# EAGLE design Spooky Sound System (EAGLE 7.6.0)
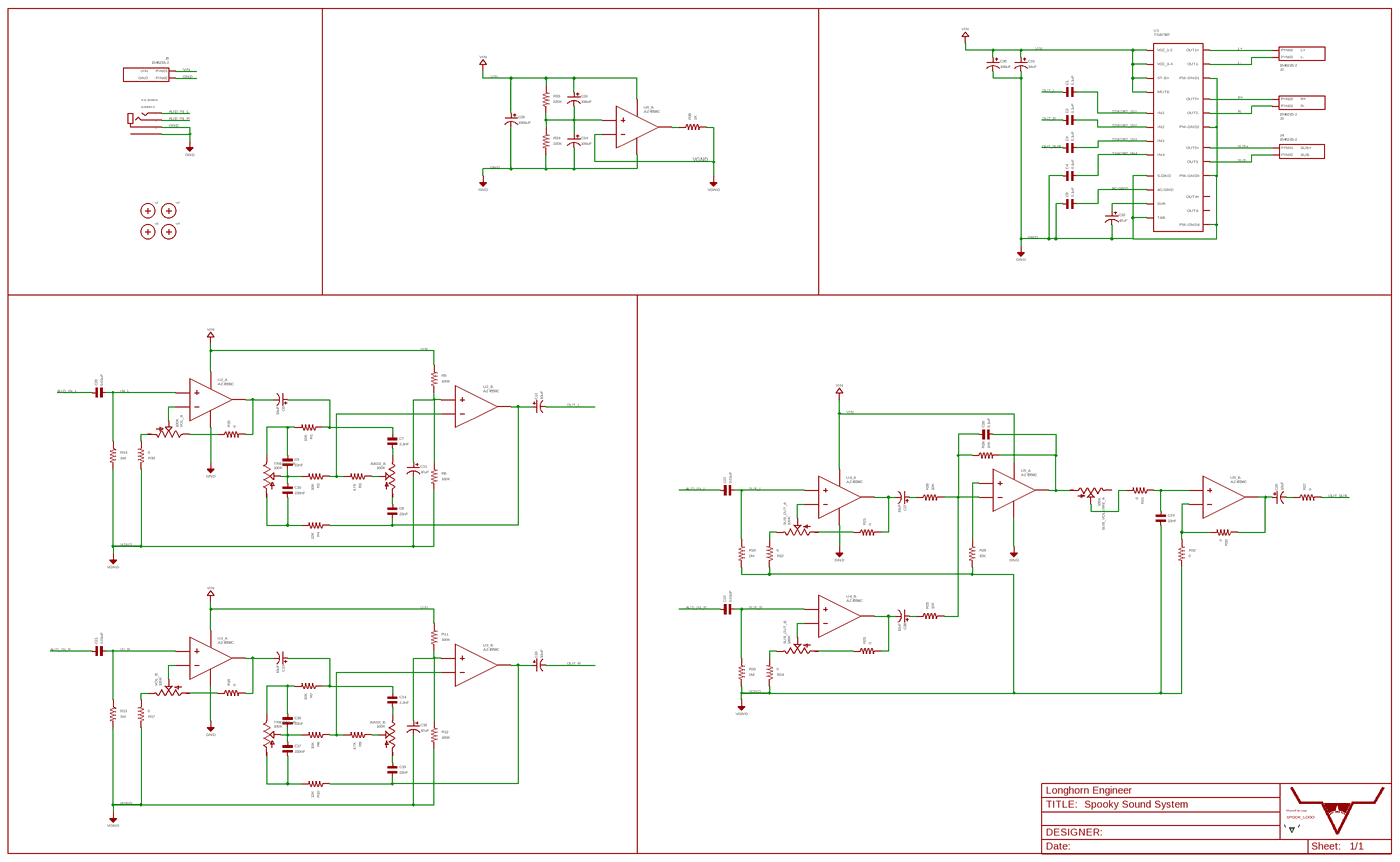
[diagram p0: schematic, sheet 1, overview]
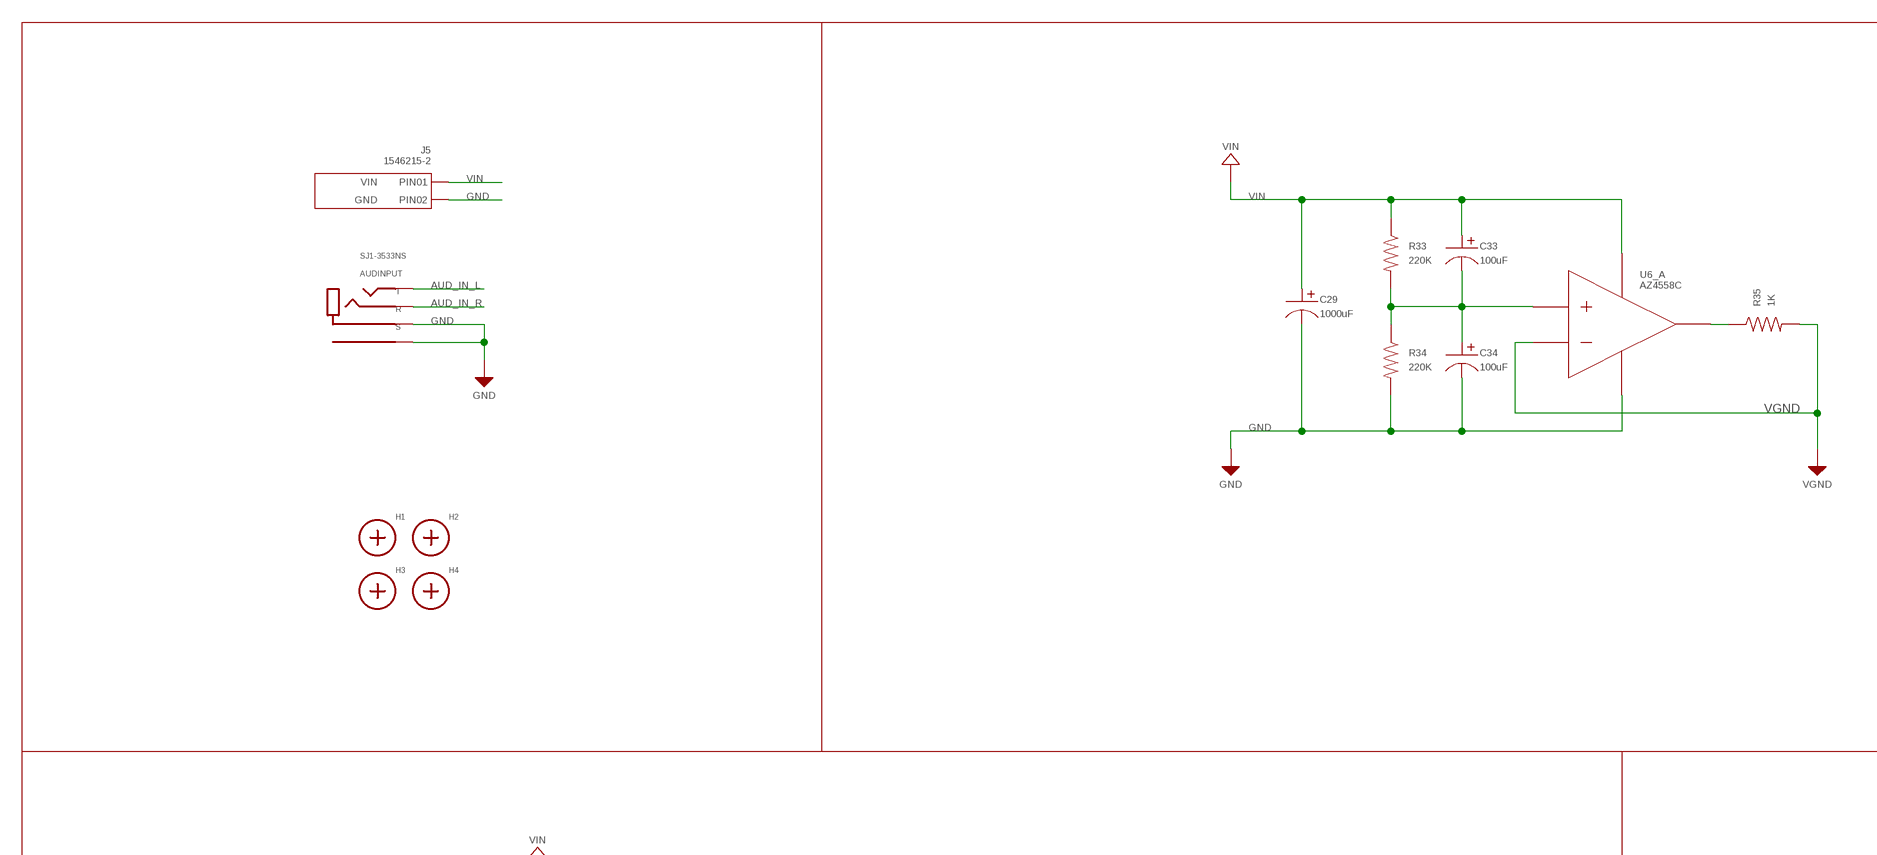
[diagram p1: schematic, sheet 1, part 1 of 4]
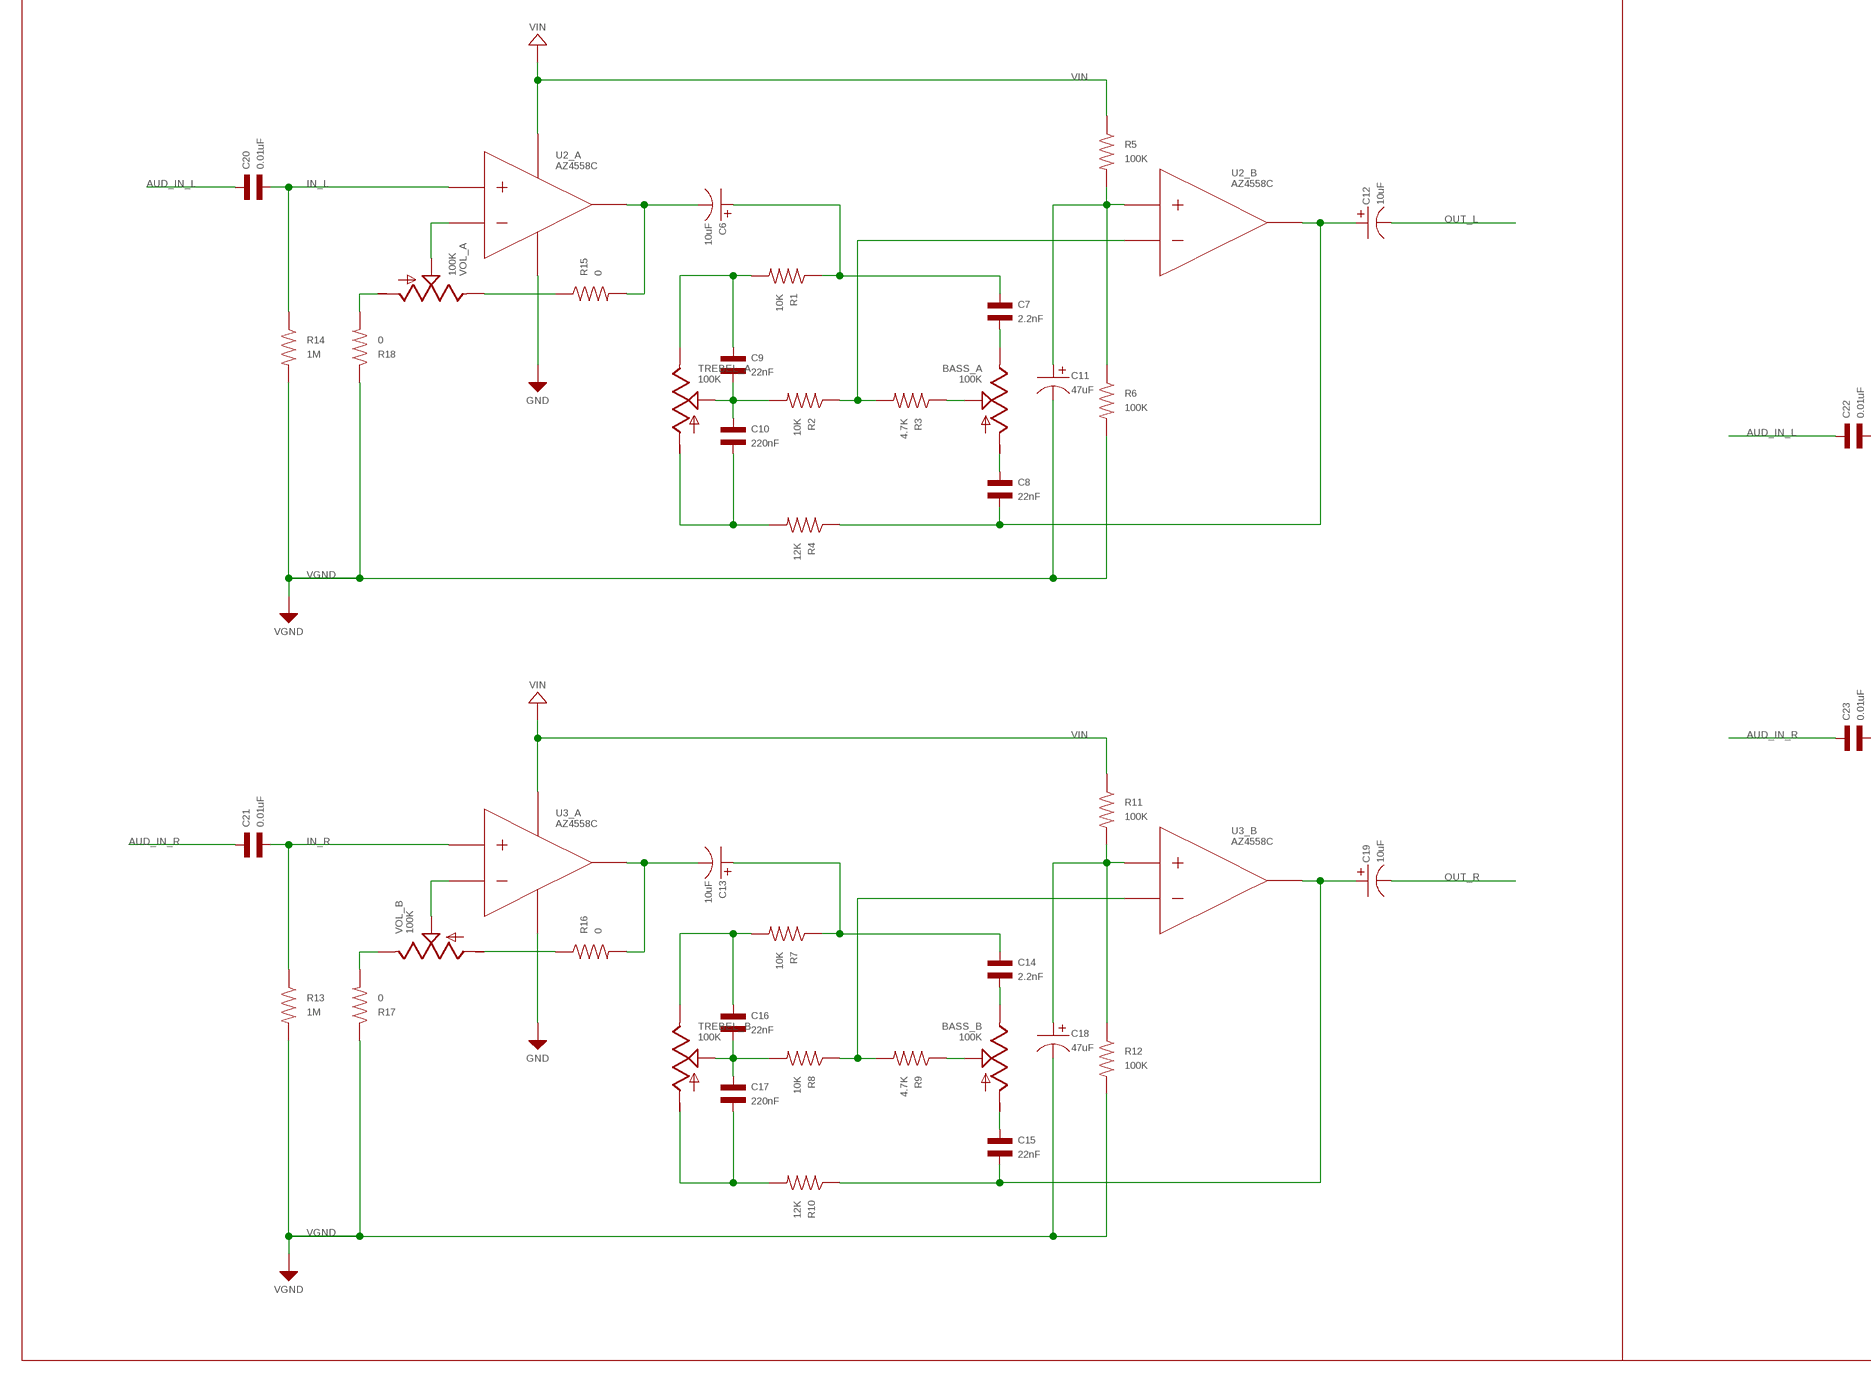
[diagram p2: schematic, sheet 1, part 2 of 4]
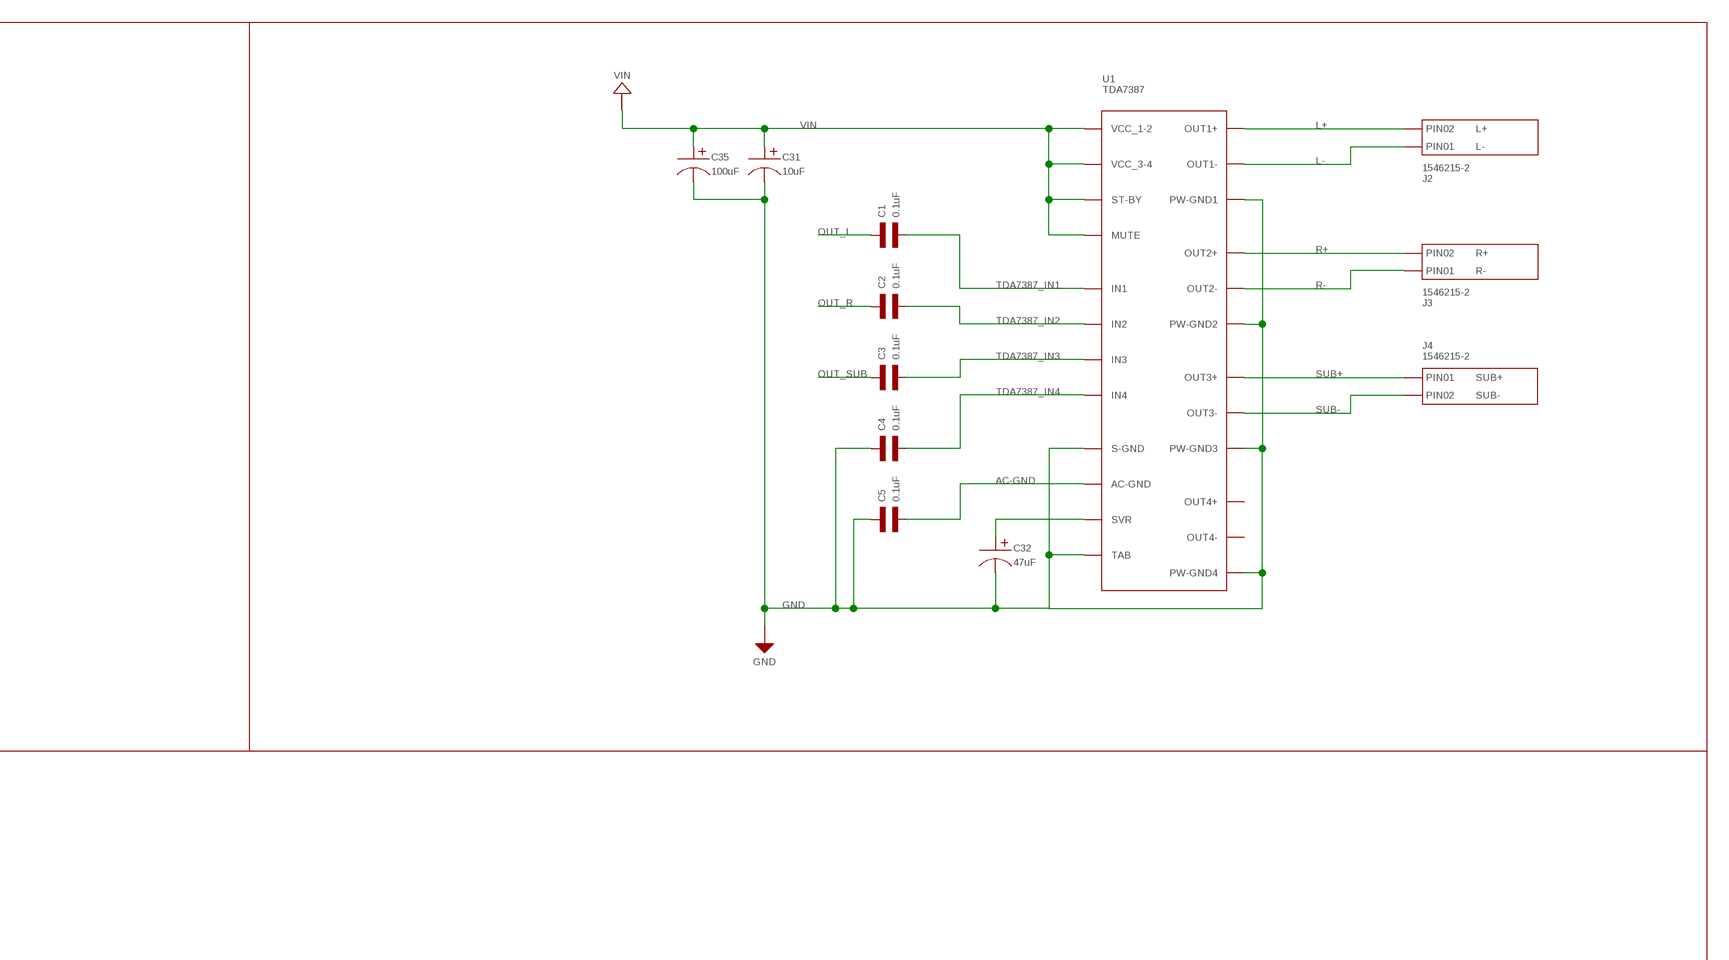
[diagram p3: schematic, sheet 1, part 3 of 4]
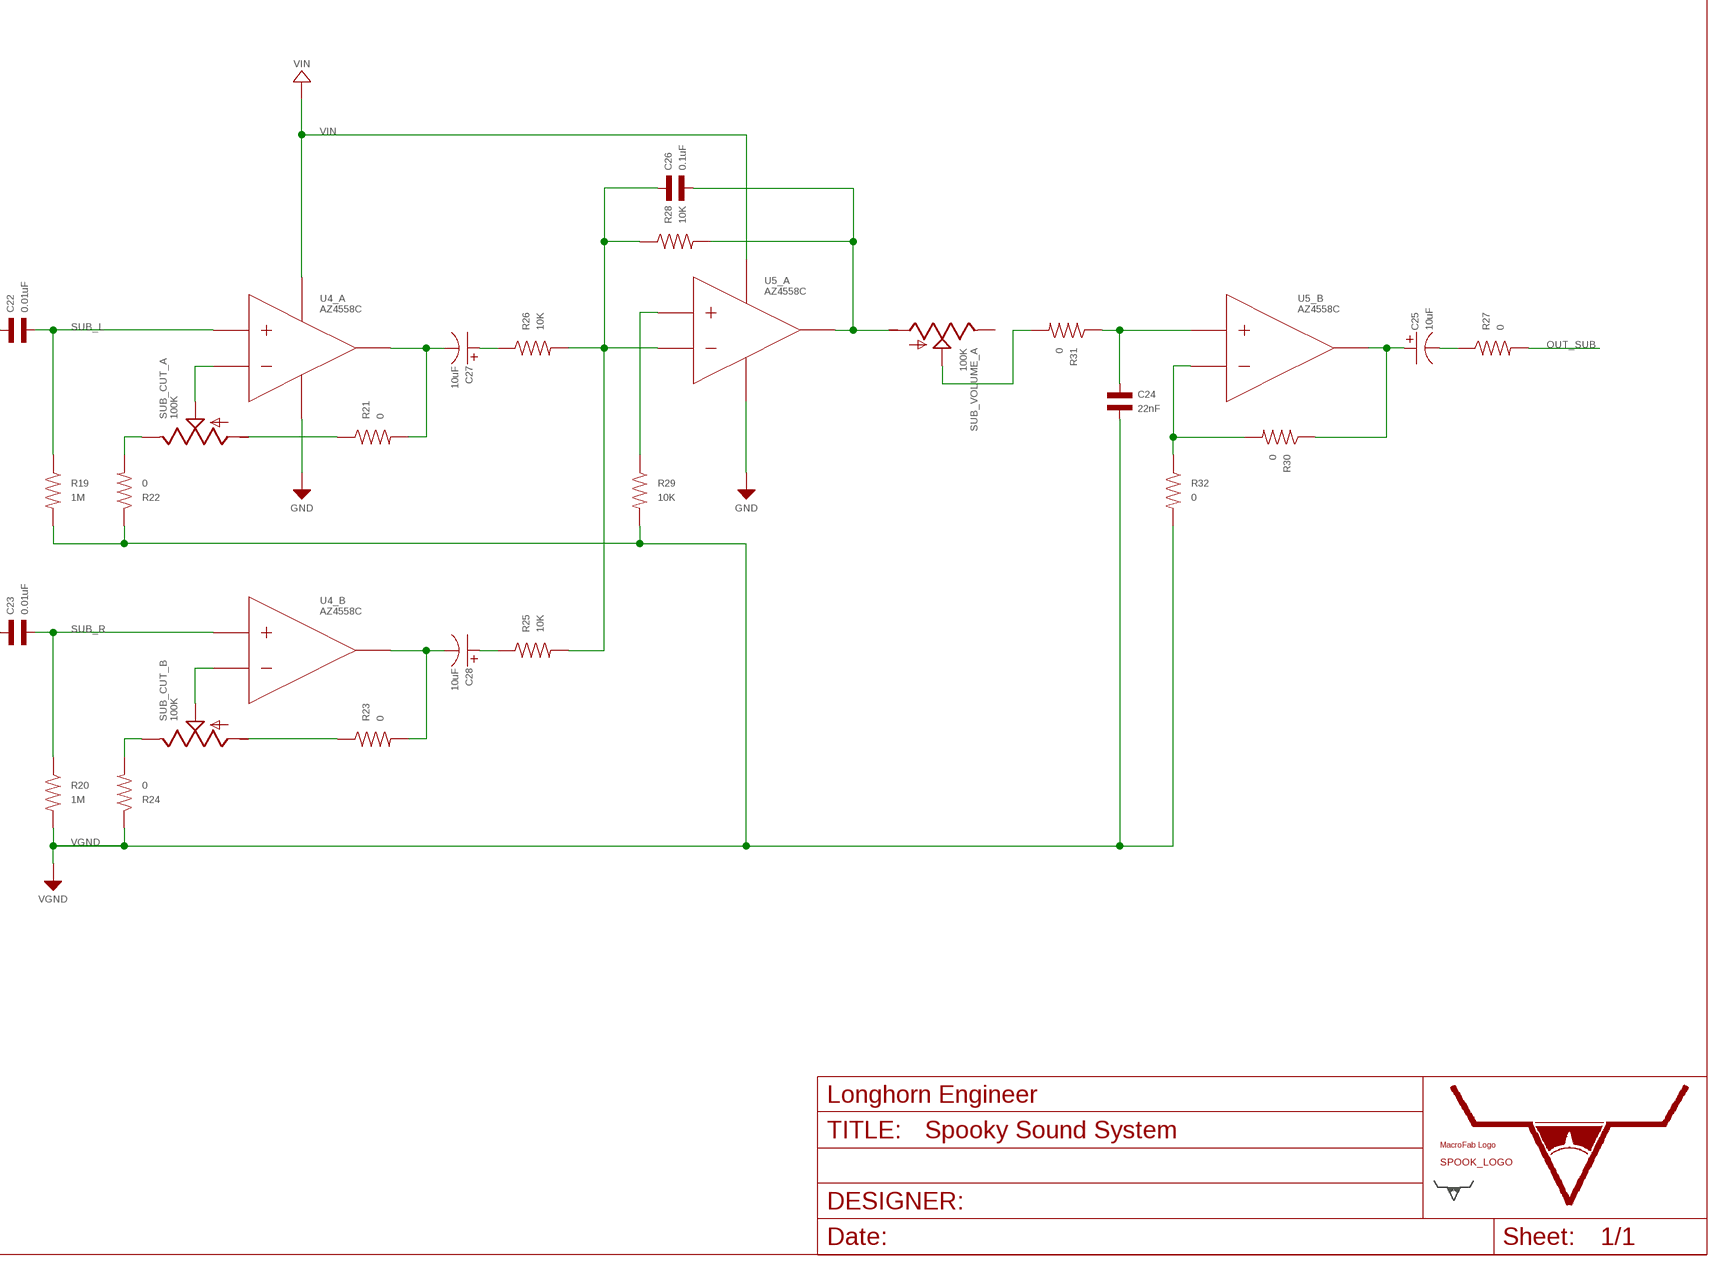
[diagram p4: schematic, sheet 1, part 4 of 4]

## Parts
AUDINPUT  SJ1-3533NS  TRS_SHIELD_JACK_SJ1-3533NS  [SJ1-3533NS]
BASS  100K  DUAL_TAPER_POTENTIOMETER  [DUAL_TAPER_POTENTIOMETER]
C1  0.1uF  CAPACITOR_NP_1206  [C1206]
C2  0.1uF  CAPACITOR_NP_1206  [C1206]
C3  0.1uF  CAPACITOR_NP_1206  [C1206]
C4  0.1uF  CAPACITOR_NP_1206  [C1206]
C5  0.1uF  CAPACITOR_NP_1206  [C1206]
C6  10uF  CAPACITOR_P_4MM  [CP4MM]
C7  2.2nF  CAPACITOR_NP_0805  [C0805]
C8  22nF  CAPACITOR_NP_0805  [C0805]
C9  22nF  CAPACITOR_NP_0805  [C0805]
C10  220nF  CAPACITOR_NP_0805  [C0805]
C11  47uF  CAPACITOR_P_6.3MM  [CP6.3MM]
C12  10uF  CAPACITOR_P_4MM  [CP4MM]
C13  10uF  CAPACITOR_P_4MM  [CP4MM]
C14  2.2nF  CAPACITOR_NP_0805  [C0805]
C15  22nF  CAPACITOR_NP_0805  [C0805]
C16  22nF  CAPACITOR_NP_0805  [C0805]
C17  220nF  CAPACITOR_NP_0805  [C0805]
C18  47uF  CAPACITOR_P_6.3MM  [CP6.3MM]
C19  10uF  CAPACITOR_P_4MM  [CP4MM]
C20  0.01uF  CAPACITOR_NP_1210  [C1210]
C21  0.01uF  CAPACITOR_NP_1210  [C1210]
C22  0.01uF  CAPACITOR_NP_1210  [C1210]
C23  0.01uF  CAPACITOR_NP_1210  [C1210]
C24  22nF  CAPACITOR_NP_0805  [C0805]
C25  10uF  CAPACITOR_P_4MM  [CP4MM]
C26  0.1uF  CAPACITOR_NP_0805  [C0805]
C27  10uF  CAPACITOR_P_4MM  [CP4MM]
C28  10uF  CAPACITOR_P_4MM  [CP4MM]
C29  1000uF  CAPACITOR_P_12.5MM  [CP12.5MM]
C31  10uF  CAPACITOR_P_4MM  [CP4MM]
C32  47uF  CAPACITOR_P_6.3MM  [CP6.3MM]
C33  100uF  CAPACITOR_P_6.3MM  [CP6.3MM]
C34  100uF  CAPACITOR_P_6.3MM  [CP6.3MM]
C35  100uF  CAPACITOR_P_6.3MM  [CP6.3MM]
H1  MOUNT_HOLE150MIL  [MOUNT_HOLE_150MIL]
H2  MOUNT_HOLE150MIL  [MOUNT_HOLE_150MIL]
H3  MOUNT_HOLE150MIL  [MOUNT_HOLE_150MIL]
H4  MOUNT_HOLE150MIL  [MOUNT_HOLE_150MIL]
J2  1546215-2  CON_01X02_1546215-2  [1546215-2]
J3  1546215-2  CON_01X02_1546215-2  [1546215-2]
J4  1546215-2  CON_01X02_1546215-2  [1546215-2]
J5  1546215-2  CON_01X02_1546215-2  [1546215-2]
LOGO1  SPOOKY_LOGOSPOOKY_LOGO  [SPOOKY_LOGO]
R1  10K  RESISTOR_0805  [R0805]
R2  10K  RESISTOR_0805  [R0805]
R3  4.7K  RESISTOR_0805  [R0805]
R4  12K  RESISTOR_0805  [R0805]
R5  100K  RESISTOR_0805  [R0805]
R6  100K  RESISTOR_0805  [R0805]
R7  10K  RESISTOR_0805  [R0805]
R8  10K  RESISTOR_0805  [R0805]
R9  4.7K  RESISTOR_0805  [R0805]
R10  12K  RESISTOR_0805  [R0805]
R11  100K  RESISTOR_0805  [R0805]
R12  100K  RESISTOR_0805  [R0805]
R13  1M  RESISTOR_0805  [R0805]
R14  1M  RESISTOR_0805  [R0805]
R15  0  RESISTOR_0805  [R0805]
R16  0  RESISTOR_0805  [R0805]
R17  0  RESISTOR_0805  [R0805]
R18  0  RESISTOR_0805  [R0805]
R19  1M  RESISTOR_0805  [R0805]
R20  1M  RESISTOR_0805  [R0805]
R21  0  RESISTOR_0805  [R0805]
R22  0  RESISTOR_0805  [R0805]
R23  0  RESISTOR_0805  [R0805]
R24  0  RESISTOR_0805  [R0805]
R25  10K  RESISTOR_0805  [R0805]
R26  10K  RESISTOR_0805  [R0805]
R27  0  RESISTOR_0805  [R0805]
R28  10K  RESISTOR_0805  [R0805]
R29  10K  RESISTOR_0805  [R0805]
R30  0  RESISTOR_0805  [R0805]
R31  0  RESISTOR_0805  [R0805]
R32  0  RESISTOR_0805  [R0805]
R33  220K  RESISTOR_0805  [R0805]
R34  220K  RESISTOR_0805  [R0805]
R35  1K  RESISTOR_0805  [R0805]
SUB_CUT  100K  DUAL_TAPER_POTENTIOMETER  [DUAL_TAPER_POTENTIOMETER]
SUB_VOLUME  100K  DUAL_TAPER_POTENTIOMETER  [DUAL_TAPER_POTENTIOMETER]
TREBEL  100K  DUAL_TAPER_POTENTIOMETER  [DUAL_TAPER_POTENTIOMETER]
U1  TDA7387  [TDA7387-FLEXIWATT-25]
U2  AZ4558C  [AZ4558C_SOIC-8]
U3  AZ4558C  [AZ4558C_SOIC-8]
U4  AZ4558C  [AZ4558C_SOIC-8]
U5  AZ4558C  [AZ4558C_SOIC-8]
U6  AZ4558C  [AZ4558C_SOIC-8]
U$17  LHE_FRAME  [LHE_FRAME]
U$18  LHE_LOGOLHE_LOGO  [LHE_LOGO]
U$19  MF_LOGOLOGO_TEXT  [MF_LOGO_TEXT]
VOL  100K  DUAL_TAPER_POTENTIOMETER  [DUAL_TAPER_POTENTIOMETER]

## Nets
AC-GND: C5.P$2 U1.P$16(AC-GND)
AUD_IN_L: AUDINPUT.2_A(T) AUDINPUT.2_B(T) C20.P$1 C22.P$1
AUD_IN_R: AUDINPUT.3_A(R) AUDINPUT.3_B(R) C21.P$1 C23.P$1
GND: AUDINPUT.1_A(S) AUDINPUT.1_B(S) AUDINPUT.S1(SHIELD) AUDINPUT.S2(SHIELD) AUDINPUT.S3(SHIELD) AUDINPUT.S4(SHIELD) AUDINPUT.S5(SHIELD) AUDINPUT.S6(SHIELD) C4.P$1 C5.P$1 C29.P$2 C31.P$2 C32.P$2 C34.P$2 C35.P$2 J5.P$2(PIN2) R34.P$2 U1.P$1(TAB) U1.P$2(PW-GND2) U1.P$8(PW-GND1) U1.P$13(S-GND) U1.P$18(PW-GND3) U1.P$24(PW-GND4) U2.4(_A:VEE) U3.4(_A:VEE) U4.4(_A:VEE) U5.4(_A:VEE) U6.4(_A:VEE)
IN_L: C20.P$2 R14.P$1 U2.3(_A:INPUT_1+)
IN_R: C21.P$2 R13.P$1 U3.3(_A:INPUT_1+)
L+: J2.P$2(PIN2) U1.P$9(OUT1+)
L-: J2.P$1(PIN1) U1.P$7(OUT1-)
N$1: C6.P$2 R15.P$2 U2.1(_A:OUTPUT_1)
N$2: C6.P$1 C7.P$1 R1.P$1
N$3: C9.P$1 R1.P$2 TREBEL.1A
N$4: C9.P$2 C10.P$1 R2.P$2 TREBEL.2A
N$5: C10.P$2 R4.P$2 TREBEL.3A
N$6: R2.P$1 R3.P$2 U2.6(_B:INPUT_2-)
N$7: BASS.2A R3.P$1
N$8: BASS.1A C7.P$2
N$9: BASS.3A C8.P$1
N$10: C8.P$2 C12.P$1 R4.P$1 U2.7(_B:OUTPUT_2)
N$11: C11.P$1 R5.P$2 R6.P$1 U2.5(_B:INPUT_2+)
N$12: C13.P$2 R16.P$2 U3.1(_A:OUTPUT_1)
N$13: C13.P$1 C14.P$1 R7.P$1
N$14: C16.P$1 R7.P$2 TREBEL.1B
N$15: C16.P$2 C17.P$1 R8.P$2 TREBEL.2B
N$16: C17.P$2 R10.P$2 TREBEL.3B
N$17: R8.P$1 R9.P$2 U3.6(_B:INPUT_2-)
N$18: BASS.2B R9.P$1
N$19: BASS.1B C14.P$2
N$20: BASS.3B C15.P$1
N$21: C15.P$2 C19.P$1 R10.P$1 U3.7(_B:OUTPUT_2)
N$22: C18.P$1 R11.P$2 R12.P$1 U3.5(_B:INPUT_2+)
N$23: C27.P$2 R21.P$2 U4.1(_A:OUTPUT_1)
N$24: R21.P$1 SUB_CUT.3A
N$25: R16.P$1 VOL.3B
N$26: R17.P$2 VOL.1B
N$27: C28.P$2 R23.P$2 U4.7(_B:OUTPUT_2)
N$28: R23.P$1 SUB_CUT.3B
N$29: C26.P$1 R25.P$2 R26.P$2 R28.P$1 U5.2(_A:INPUT_1-)
N$30: C26.P$2 R28.P$2 SUB_VOLUME.3A U5.1(_A:OUTPUT_1)
N$31: R29.P$1 U5.3(_A:INPUT_1+)
N$32: R31.P$2 SUB_VOLUME.2A
N$33: R30.P$2 R32.P$1 U5.6(_B:INPUT_2-)
N$34: C25.P$1 R30.P$1 U5.7(_B:OUTPUT_2)
N$35: SUB_CUT.2A U4.2(_A:INPUT_1-)
N$36: R22.P$2 SUB_CUT.1A
N$37: R24.P$2 SUB_CUT.1B
N$38: SUB_CUT.2B U4.6(_B:INPUT_2-)
N$39: U3.2(_A:INPUT_1-) VOL.2B
N$40: R18.P$2 VOL.3A
N$41: U2.2(_A:INPUT_1-) VOL.2A
N$42: R15.P$1 VOL.1A
N$43: C24.P$1 R31.P$1 U5.5(_B:INPUT_2+)
N$44: C25.P$2 R27.P$1
N$45: C27.P$1 R26.P$1
N$46: C28.P$1 R25.P$1
N$47: C33.P$2 C34.P$1 R33.P$2 R34.P$1 U6.3(_A:INPUT_1+)
N$48: R35.P$1 U6.1(_A:OUTPUT_1)
N$49: C32.P$1 U1.P$10(SVR)
OUT_L: C1.P$1 C12.P$2
OUT_R: C2.P$1 C19.P$2
OUT_SUB: C3.P$1 R27.P$2
R+: J3.P$2(PIN2) U1.P$5(OUT2+)
R-: J3.P$1(PIN1) U1.P$3(OUT2-)
SUB+: J4.P$1(PIN1) U1.P$17(OUT3+)
SUB-: J4.P$2(PIN2) U1.P$19(OUT3-)
SUB_L: C22.P$2 R19.P$1 U4.3(_A:INPUT_1+)
SUB_R: C23.P$2 R20.P$1 U4.5(_B:INPUT_2+)
TDA7387_IN1: C1.P$2 U1.P$11(IN1)
TDA7387_IN2: C2.P$2 U1.P$12(IN2)
TDA7387_IN3: C3.P$2 U1.P$15(IN3)
TDA7387_IN4: C4.P$2 U1.P$14(IN4)
VGND: C11.P$2 C18.P$2 C24.P$2 R6.P$2 R12.P$2 R13.P$2 R14.P$2 R17.P$1 R18.P$1 R19.P$2 R20.P$2 R22.P$1 R24.P$1 R29.P$2 R32.P$2 R35.P$2 U6.2(_A:INPUT_1-)
VIN: C29.P$1 C31.P$1 C33.P$1 C35.P$1 J5.P$1(PIN1) R5.P$1 R11.P$1 R33.P$1 U1.P$4(ST-BY) U1.P$6(VCC_1-2) U1.P$20(VCC_3-4) U1.P$22(MUTE) U2.8(_A:VCC) U3.8(_A:VCC) U4.8(_A:VCC) U5.8(_A:VCC) U6.8(_A:VCC)
Unconnected: SUB_VOLUME.1A SUB_VOLUME.1B SUB_VOLUME.2B SUB_VOLUME.3B U1.P$21(OUT4+) U1.P$23(OUT4-) U6.5(_B:INPUT_2+) U6.6(_B:INPUT_2-) U6.7(_B:OUTPUT_2)

## Library data of the parts
AUDINPUT = PP_Connectors:TRS_SHIELD_JACK; POPULATE: 1
BASS SUB_CUT SUB_VOLUME TREBEL VOL = PP_Passives:DUAL_TAPER_POTENTIOMETER
C1-C5 = MF_Passives:CAPACITOR_NP: Library: MF_Passives Description: Device for Non-Polarized Capacitors. Manufacture part number (MPN) can be added via Attributes. Check https://factory.macrofab.com/parts for the house parts list.; MPN: VJ1206Y104JXBTW1BC; POPULATE: 1
C6 C12 C13 C19 C25 C27 C28 C31 = MF_Passives:CAPACITOR_P: Library: MF_Passives Description: Device for Polarized Capacitors. Manufacture part number (MPN), Voltage Rating, and Tolerance can be added via Attributes. Check https://factory.macrofab.com/parts for the house parts list.; MPN: MF-CAP-4MM-10uF; POPULATE: 1
C7-C10 C14-C17 C24 C26 = MF_Passives:CAPACITOR_NP: Library: MF_Passives Description: Device for Non-Polarized Capacitors. Manufacture part number (MPN) can be added via Attributes. Check https://factory.macrofab.com/parts for the house parts list.; POPULATE: 1
C11 C18 C32 = MF_Passives:CAPACITOR_P: Library: MF_Passives Description: Device for Polarized Capacitors. Manufacture part number (MPN), Voltage Rating, and Tolerance can be added via Attributes. Check https://factory.macrofab.com/parts for the house parts list.; MPN: MF-CAP-6.3MM-47uF; POPULATE: 1
C20-C23 = MF_Passives:CAPACITOR_NP: Library: MF_Passives Description: Device for Non-Polarized Capacitors. Manufacture part number (MPN) can be added via Attributes. Check https://factory.macrofab.com/parts for the house parts list.; MPN: CB017E0103KBA; POPULATE: 1
C29 = MF_Passives:CAPACITOR_P: Library: MF_Passives Description: Device for Polarized Capacitors. Manufacture part number (MPN), Voltage Rating, and Tolerance can be added via Attributes. Check https://factory.macrofab.com/parts for the house parts list.; MPN: MF-CAP-12.5MM-1000uF; POPULATE: 1
C33-C35 = MF_Passives:CAPACITOR_P: Library: MF_Passives Description: Device for Polarized Capacitors. Manufacture part number (MPN), Voltage Rating, and Tolerance can be added via Attributes. Check https://factory.macrofab.com/parts for the house parts list.; MPN: MF-CAP-6.3MM-100uF; POPULATE: 1
H1-H4 = PP_Connectors:MOUNT_HOLE; POPULATE: 1
J2 = PP_Connectors:CON_01X02; LABEL01: L-; LABEL02: L+; POPULATE: 1
J3 = PP_Connectors:CON_01X02; LABEL01: R-; LABEL02: R+; POPULATE: 1
J4 = PP_Connectors:CON_01X02; LABEL01: SUB+; LABEL02: SUB-; POPULATE: 1
J5 = PP_Connectors:CON_01X02; LABEL01: VIN; LABEL02: GND; POPULATE: 1
LOGO1 = PP_Aesthetics:SPOOKY_LOGO
R1-R31 R33-R35 = MF_Passives:RESISTOR: Library: MF_Passives Description: Device for Resistors. Manufacture part number (MPN), Voltage, Tolerance, and Wattage Rating can be added via Attributes. Check https://factory.macrofab.com/parts for the house parts list.; POPULATE: 1
R32 = MF_Passives:RESISTOR: Library: MF_Passives Description: Device for Resistors. Manufacture part number (MPN), Voltage, Tolerance, and Wattage Rating can be added via Attributes. Check https://factory.macrofab.com/parts for the house parts list.; POPULATE: 0
U1 = PP_AnalogIC:TDA7387
U2-U6 = PP_AnalogIC:AZ4558C
U$17 = PP_Aesthetics:LHE_FRAME; DNAME: Parker Dillmann; REVNUM: REV: 1
U$18 = PP_Aesthetics:LHE_LOGO
U$19 = PP_Aesthetics:MF_LOGO

## Net classes
0 default: clearance 0.205 mm

## Board
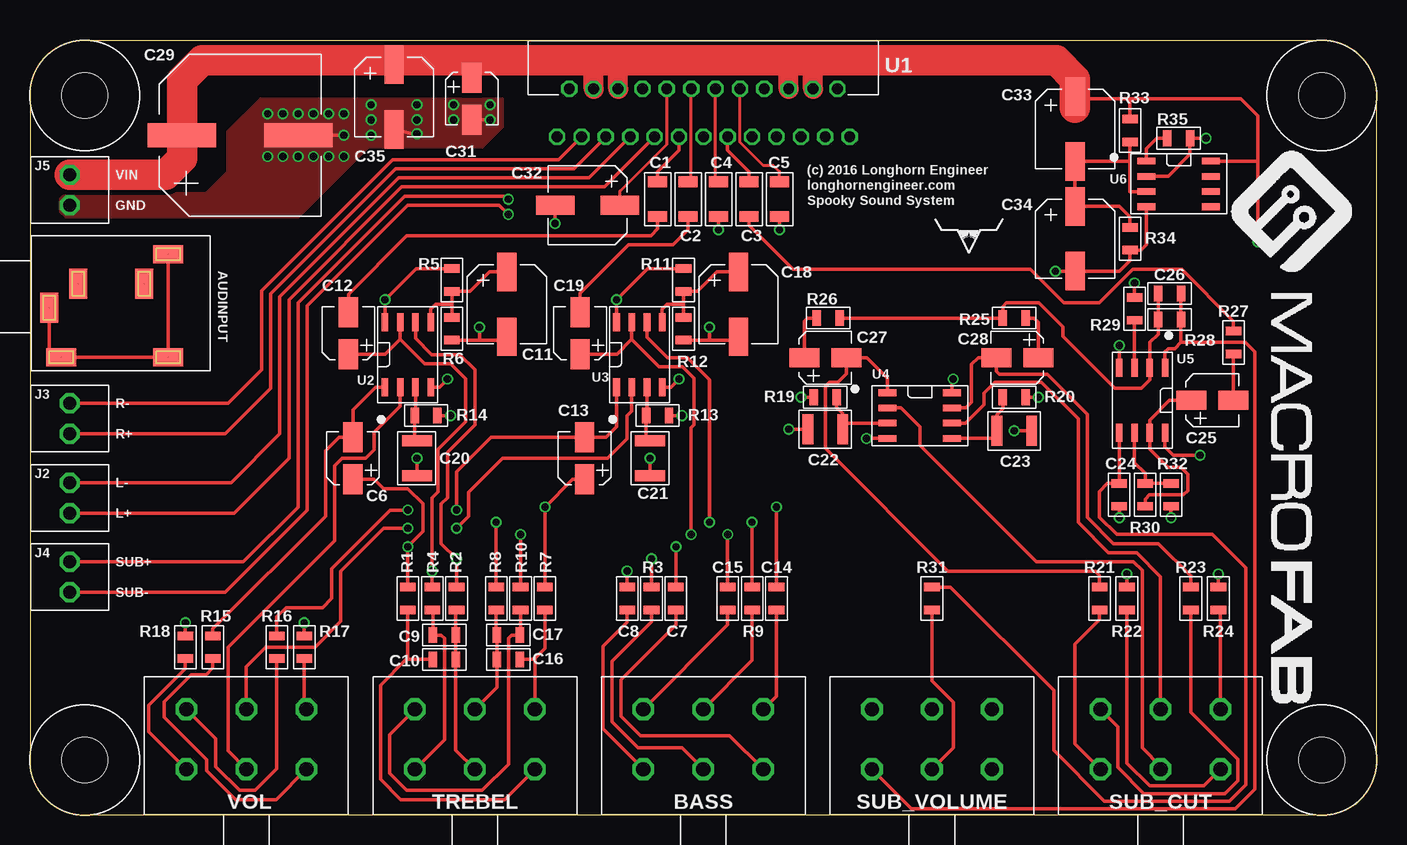
[diagram p5: board, top side]
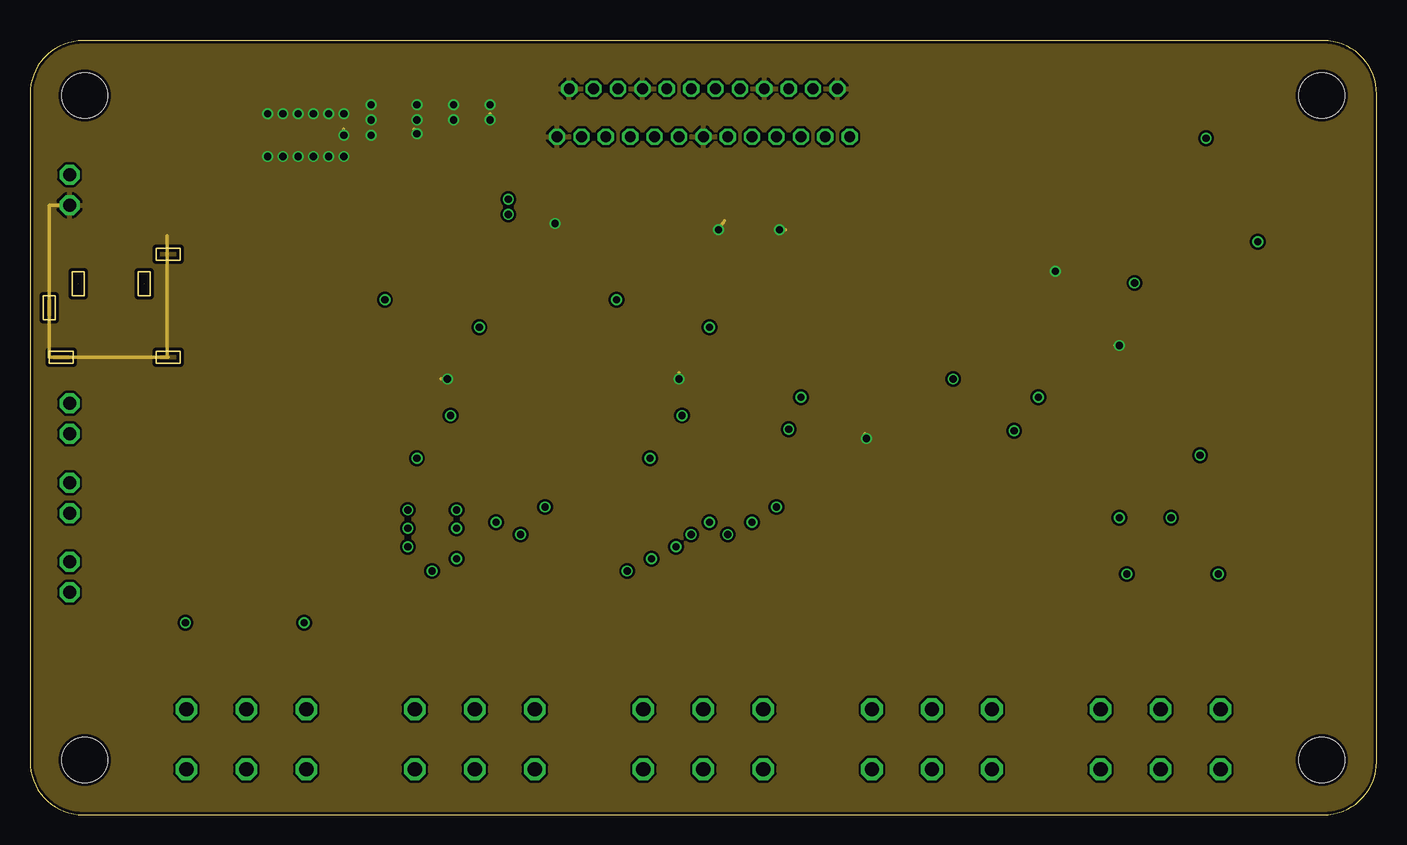
[diagram p6: board, inner layer Route2]
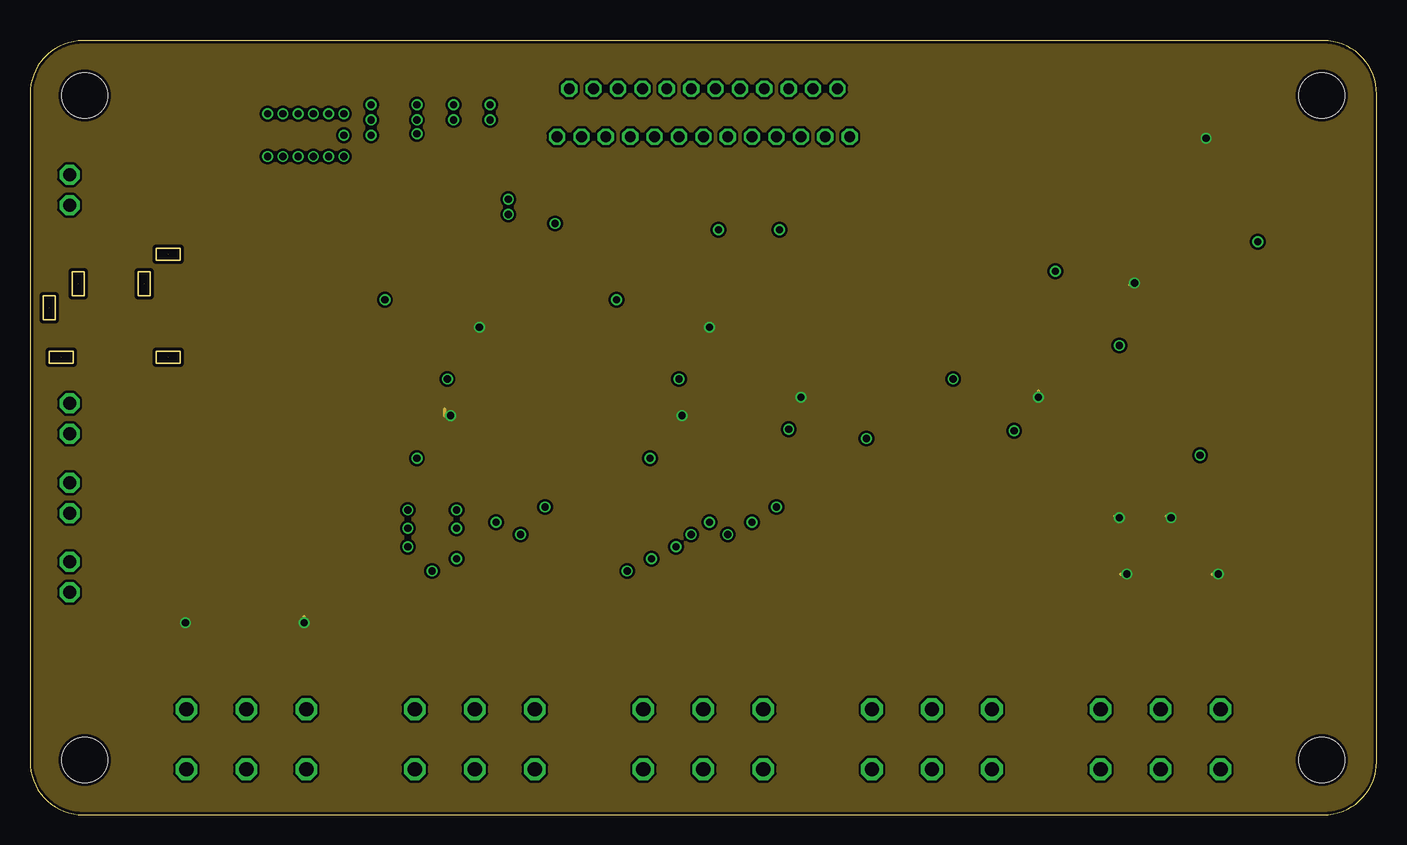
[diagram p7: board, inner layer Route15]
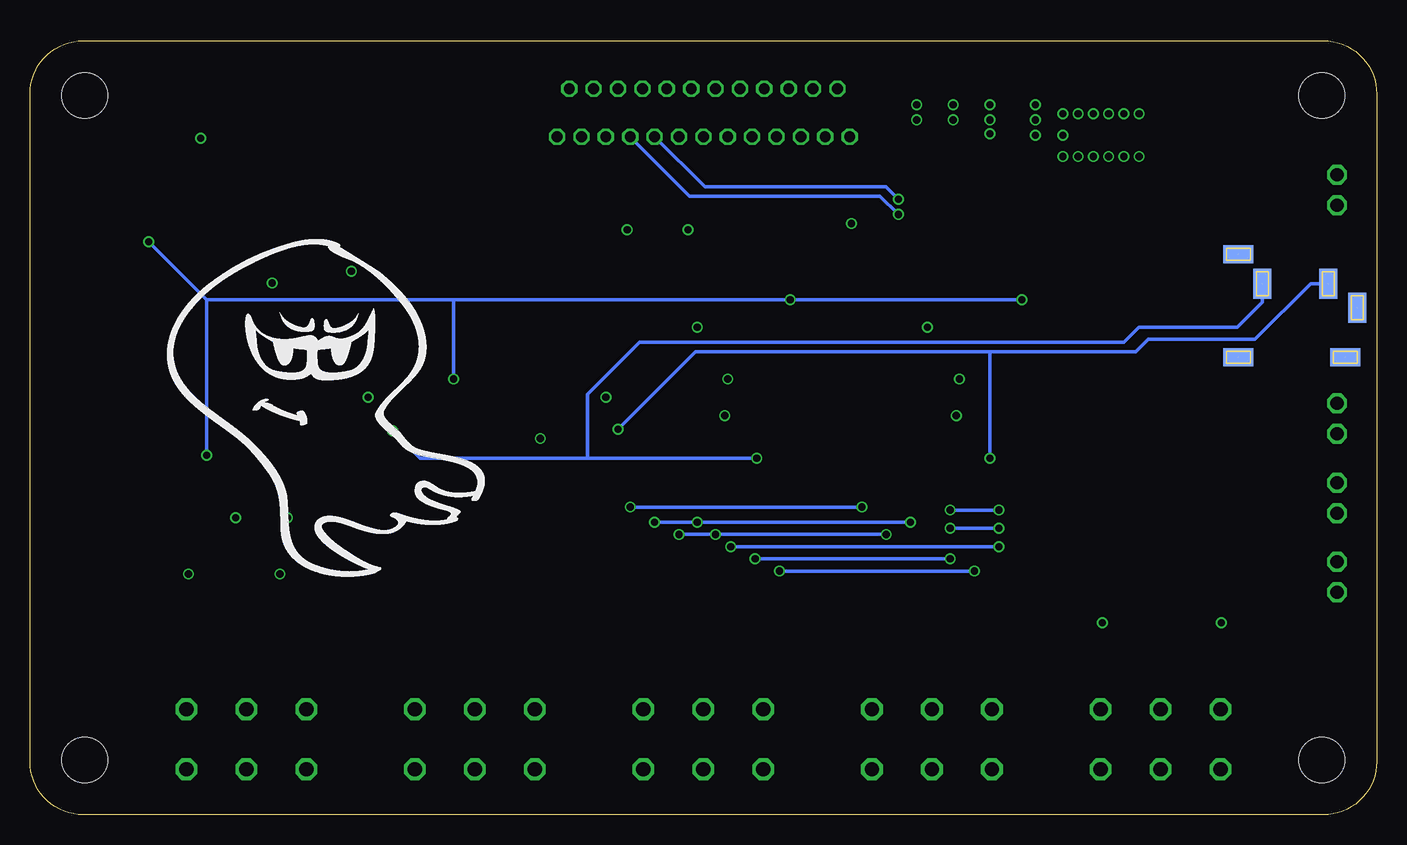
[diagram p8: board, bottom side, seen from below]

Size 112.27 x 64.52 mm. Coordinates in mm from the lower left corner, seen from the top.
Outline: 0,60.07 0,4.45 arc90 4.45,0 107.82,0 arc90 112.27,4.45 112.27,60.07 arc90 107.82,64.52 4.45,64.52 arc90 0,60.07
Copper layers (1*2*15*16): Top 0.035mm / dielectric 0.23mm / Route2 0.035mm / dielectric 0.93mm / Route15 0.035mm / dielectric 0.23mm / Bottom 0.035mm
Design rules "MF_Standard_4_Layer": minimum track width 5mil, minimum drill 12mil, track to track 5mil, track to pad 5mil, pad to pad 5mil, via to via 5mil, smd to smd 0mil, copper to edge 10mil, drill to drill 10mil, minimum pad ring 6mil, minimum via ring 6mil, stop-mask expansion 2mil, vias tented up to drill 25mil, thermal gap 10mil

### Footprints (pad centres in the part's own frame; a part is rotated, then mirrored left to right if it is on the bottom)
SJ1-3533NS = smd 1.5 x 2.5: 1_A -6,-0.4; 2_A -3.6,1.6; 3_A 1.9,1.6 | smd 1.5 x 2.5 bottom: 1_B -6,-0.4; 2_B -3.6,1.6; 3_B 1.9,1.6 | smd 2.5 x 1.5: S1 -5,-4.55; S2 3.9,-4.55; S3 3.9,4.05 | smd 2.5 x 1.5 bottom: S4 3.9,4.05; S5 3.9,-4.55; S6 -5,-4.55
DUAL_TAPER_POTENTIOMETER = drill 1.2 octagon: 1A -5,-3.8; 1B -5,-8.8; 2A 0,-3.8; 2B 0,-8.8; 3A 5,-3.8; 3B 5,-8.8
C1206 = smd 0.9 x 1.6: P$1 -1.45,0; P$2 1.45,0
CP4MM = smd 1.6 x 2.5: P$1 0,-1.75; P$2 0,1.75
C0805 = smd 0.7 x 1.3: P$1 -0.95,0; P$2 0.95,0
CP6.3MM = smd 1.6 x 3.2: P$1 0,-2.7; P$2 0,2.7
C1210 = smd 0.9 x 2.5: P$1 -1.45,0; P$2 1.45,0
CP12.5MM = smd 2 x 5.7: P$1 0,-4.85; P$2 0,4.85
MOUNT_HOLE_150MIL = hole 3.81: 0,0
1546215-2 = drill 1.1 octagon: P$1 -1.27,0; P$2 1.27,0
R0805 = smd 0.7 x 1.3: P$1 -0.95,0; P$2 0.95,0
TDA7387-FLEXIWATT-25 = drill 0.9 octagon: P$1 -12.192,0; P$2 -11.176,3.988; P$3 -10.16,0; P$4 -9.144,3.988; P$5 -8.128,0; P$6 -7.112,3.988; P$7 -6.096,0; P$8 -5.08,3.988; P$9 -4.064,0; P$10 -3.048,3.988; P$11 -2.032,0; P$12 -1.016,3.988; P$13 0,0; P$14 1.016,3.988; P$15 2.032,0; P$16 3.048,3.988; P$17 4.064,0; P$18 5.08,3.988; P$19 6.096,0; P$20 7.112,3.988; P$21 8.128,0; P$22 9.144,3.988; P$23 10.16,0; P$24 11.176,3.988; P$25 12.192,0
AZ4558C_SOIC-8 = smd 1.5 x 0.55: 1 -2.7,1.905; 2 -2.7,0.635; 3 -2.7,-0.635; 4 -2.7,-1.905; 5 2.7,-1.905; 6 2.7,-0.635; 7 2.7,0.635; 8 2.7,1.905

### Placement (x,y rotation side)
AUDINPUT  7.62,42.67 0 top
BASS  56.13,0 180 top
C1  52.32,51.31 90 top
C2  54.86,51.31 90 top
C3  59.94,51.31 90 top
C4  57.4,51.31 90 top
C5  62.48,51.31 90 top
C6  26.92,29.72 0 top
C7  53.85,18.03 270 top
C8  49.78,18.03 90 top
C9  34.54,12.95 0 top
C10  34.54,14.99 180 top
C11  39.75,42.55 180 top
C12  26.54,40.13 0 top
C13  46.23,29.72 0 top
C14  62.23,18.03 270 top
C15  58.17,18.03 90 top
C16  39.88,12.95 180 top
C17  39.88,14.99 0 top
C18  59.05,42.55 180 top
C19  45.85,40.13 0 top
C20  32.26,29.72 90 top
C21  51.69,29.72 90 top
C22  66.29,32.13 0 top
C23  82.04,32 180 top
C24  90.81,26.67 270 top
C25  98.55,34.54 270 top
C26  95,43.43 0 top
C27  66.29,38.1 270 top
C28  82.3,38.1 90 top
C29  17.53,56.64 270 top
C31  36.83,59.69 180 top
C32  46.48,50.8 90 top
C33  87.12,57.15 180 top
C34  87.12,48.01 180 top
C35  30.35,59.82 180 top
H1  4.57,4.57 0 top
H2  107.7,4.57 0 top
H3  107.7,59.94 0 top
H4  4.57,59.94 0 top
J2  3.3,26.42 270 top
J3  3.3,33.02 270 top
J4  3.3,19.81 270 top
J5  3.3,52.07 270 top
LOGO1  100.84,19.81 0 bottom
R1  31.5,18.03 270 top
R2  35.56,18.03 270 top
R3  51.82,18.03 90 top
R4  33.53,18.03 270 top
R5  35.18,44.58 270 top
R6  35.18,40.51 270 top
R7  42.93,18.03 270 top
R8  38.86,18.03 270 top
R9  60.2,18.03 90 top
R10  40.89,18.03 270 top
R11  54.48,44.58 270 top
R12  54.48,40.51 270 top
R13  52.32,33.27 0 top
R14  33.02,33.27 0 top
R15  15.24,13.97 90 top
R16  20.57,13.97 90 top
R17  22.86,13.97 270 top
R18  12.95,13.97 270 top
R19  66.29,34.8 180 top
R20  82.04,34.8 0 top
R21  89.15,18.03 90 top
R22  91.44,18.03 270 top
R23  96.77,18.03 90 top
R24  99.06,18.03 270 top
R25  82.04,41.4 180 top
R26  66.55,41.4 0 top
R27  100.33,39.37 90 top
R28  95,41.27 0 top
R29  92.08,42.16 90 top
R30  92.96,26.67 90 top
R31  75.18,18.03 270 top
R32  95.12,26.67 270 top
R33  91.69,57.02 270 top
R34  91.69,48.01 270 top
R35  95.76,56.39 0 top
SUB_CUT  94.23,0 180 top
SUB_VOLUME  75.18,0 180 top
TREBEL  37.08,0 180 top
U1  56.13,56.52 0 top
U2  31.5,38.35 90 top
U3  50.8,38.35 90 top
U4  74.17,33.27 0 top
U5  92.71,34.54 270 top
U6  95.76,52.58 0 top
U$17  64.77,48.26 0 top
U$18  80.26,46.74 0 top
U$19  100.08,55.12 270 top
VOL  18.03,0 180 top

### Tracks (layer width: path | path; a pad name or v marks a point on that pad's centre or on a via)
AC-GND
  Top 0.254: U1.P$16 59.18,56.06 61.14,54.1 61.98,54.1 62.48,53.59 C5.P$2
AUD_IN_L  (via drill 0.6)  (1 unrouted)
  Top 0.305: v63.25,32.13 C22.P$1 | C20.P$1 v32.26,29.72
  Bottom 0.305: 32.26,38.61 56.77,38.61 v63.25,32.13 | v32.26,29.72 32.26,38.61 | AUDINPUT.2_B 5.51,44.27 10.16,39.62 19.05,39.62 20.07,38.61 32.26,38.61
AUD_IN_R  (via drill 0.6)  (1 unrouted)
  Top 0.305: v82.04,32 C23.P$1 | C21.P$1 v51.69,29.72
  Bottom 0.305: AUDINPUT.3_B 9.52,42.73 11.61,40.64 19.81,40.64 21.08,39.37 61.46,39.37 65.79,35.05 65.79,29.72 | v51.69,29.72 65.79,29.72 | 65.79,29.72 79.76,29.72 v82.04,32
GND  (via drill 0.6)  (5 unrouted)
  Top 0.305: U4.4 v69.72,31.37 | U5.4 v90.81,39.12 | v85.47,45.31 C34.P$2 90.83,45.31 91.69,46.17 R34.P$2 92.61,47.06 93.06,47.51 U6.4 | C32.P$2 v43.78,49.28 | C5.P$1 v62.48,48.77 | C4.P$1 v57.4,48.77 | U3.4 53.43,35.65 v54.1,36.32 | U2.4 34.13,35.65 v34.8,36.32 | C29.P$2 v26.16,56.64 | C35.P$2 32,56.74 v32.26,56.77 | C31.P$2 38.35,57.94 v38.35,57.91 | AUDINPUT.1_B 1.62,38.12 AUDINPUT.S1 AUDINPUT.S5 AUDINPUT.S3
  Route2 0.305: v69.72,31.37 69.72,31.62 69.6,31.75 | v90.81,39.12 90.42,39.12 | v62.48,48.77 62.99,48.77 | v57.4,48.77 57.91,49.53 | v54.1,36.32 54.1,36.83 | v34.8,36.32 34.29,36.32 | v26.16,56.64 26.16,57.15 | v32.26,56.77 32,57.15 | v38.35,57.91 38.35,58.42 | J5.P$2 1.62,50.8 1.62,38.12 11.43,38.12 | AUDINPUT.S5 11.43,38.12 | 11.43,38.12 11.43,48.26
  other vias: 26.16,58.42 24.89,58.42 23.62,58.42 22.35,58.42 21.08,58.42 19.81,58.42 28.45,59.18 28.45,57.91 28.45,56.64 32.26,59.18 32.26,57.91 38.35,59.18 35.31,59.18 35.31,57.91 26.16,54.86 24.89,54.86 23.62,54.86 22.35,54.86 21.08,54.86 19.81,54.86
  pour Route2: 107.82,0 4.45,0 arc-90 0,4.45 0,60.07 arc-90 4.45,64.52 107.82,64.52 arc-90 112.27,60.07 112.27,4.45 arc-90
  pour Top (isolate 0.406, no thermals): 22.35,49.78 3,49.78 2.56,50.23 2.56,51.37 3,51.82 14.68,51.82 16.51,53.65 16.51,56.99 19.21,59.69 39.37,59.69 39.37,57.31 37.69,55.63 28.19,55.63
IN_L
  Top 0.305: C20.P$2 32.07,31.17 R14.P$1 32.13,33.27 U2.3
IN_R
  Top 0.305: C21.P$2 51.37,31.17 R13.P$1 51.44,33.27 U3.3
L+
  Top 0.305: U1.P$9 47.88,52.32 30.99,52.32 21.59,42.93 21.59,29.72 17.02,25.15 J2.P$2
L-
  Top 0.305: U1.P$7 46.61,53.09 30.73,53.09 20.83,43.18 20.83,31.75 16.76,27.69 J2.P$1
N$1
  Top 0.305: U2.1 28.81,35.65 26.92,33.77 C6.P$2 25.78,31.47 24.64,30.32 24.64,24.89 15.24,15.49 R15.P$2
N$2  (via drill 0.6)
  Top 0.305: C7.P$1 v53.85,22.35 | R1.P$1 v31.5,22.35 32.77,23.62 32.77,25.91 31.5,27.18 29.46,27.18 28.67,27.97 C6.P$1
  Bottom 0.305: v53.85,22.35 v31.5,22.35
N$3
  Top 0.305: R1.P$2 31.5,12.95 C9.P$1 31.36,12.95 29.21,10.8 29.21,2.97 30.91,1.27 39.55,1.27 TREBEL.1A
N$4
  Top 0.305: R2.P$2 35.49,17.08 C10.P$1 C9.P$2 35.49,5.39 TREBEL.2A
N$5
  Top 0.305: R4.P$2 33.59,17.08 C10.P$2 34.29,14.99 34.54,14.73 34.54,6.26 TREBEL.3A
N$6  (via drill 0.6)
  Top 0.305: R3.P$2 v51.82,21.34 | R2.P$1 v35.56,21.34 34.29,22.61 34.29,25.91 34.8,26.42 34.8,30.23 37.08,32.51 37.08,37.08 35.81,38.35 33.48,38.35 32.13,39.7 U2.6
  Bottom 0.305: v51.82,21.34 v35.56,21.34
N$7
  Top 0.305: BASS.2A 54.35,5.59 50.7,5.59 48.51,7.77 48.51,12.81 51.82,16.11 R3.P$1
N$8
  Top 0.305: BASS.1A 58.33,6.6 50.88,6.6 49.28,8.21 49.28,11.26 53.85,15.83 C7.P$2
N$9
  Top 0.305: BASS.3A 47.75,7.18 47.75,14.03 49.78,16.06 C8.P$1
N$10  (via drill 0.6)
  Top 0.305: 30.86,39.62 U2.7 | C8.P$2 v49.78,20.32 | R4.P$1 v33.53,20.32 33.53,26.42 34.04,26.92 34.04,30.48 36.32,32.77 36.32,36.32 35.05,37.59 32.89,37.59 30.86,39.62 | C12.P$1 29.62,38.38 30.86,39.62
  Bottom 0.305: v49.78,20.32 v33.53,20.32
N$11
  Top 0.305: 35.18,42.67 R5.P$2 | R6.P$1 35.18,42.55 | 35.18,42.55 R5.P$2 | R5.P$2 36.69,43.63 38.3,45.24 C11.P$1 | U2.5 33.4,42.14 33.8,42.55 35.18,42.55
N$12  (via drill 0.6)
  Top 0.305: R16.P$2 20.57,16.51 21.34,17.27 24.38,17.27 25.15,18.03 25.15,20.52 30.03,25.4 v31.5,25.4 | U3.1 48.9,32.34 48.02,31.47 C13.P$2 38.43,31.47 35.56,28.6 v35.56,25.4
  Bottom 0.305: v31.5,25.4 v35.56,25.4
N$13  (via drill 0.6)
  Top 0.305: C14.P$1 v62.23,25.65 | R7.P$1 v42.93,25.65 45.24,27.97 C13.P$1
  Bottom 0.305: v62.23,25.65 v42.93,25.65
N$14
  Top 0.305: TREBEL.1B 42.08,12.95 C16.P$1 42.01,12.95 42.93,13.87 R7.P$2
N$15
  Top 0.305: R8.P$2 38.86,14.99 C17.P$1 C16.P$2 38.93,10.64 TREBEL.2B
N$16
  Top 0.305: R10.P$2 40.89,14.99 C17.P$2 40.13,14.99 39.88,14.73 39.88,4.22 37.69,2.03 31.41,2.03 29.97,3.47 29.97,6.69 TREBEL.3B
N$17  (via drill 0.6)
  Top 0.305: R9.P$2 v60.2,24.38 | v38.86,24.38 R8.P$1 | v56.64,24.38 56.64,36.27 54.81,38.1 53.14,38.1 51.44,39.81 U3.6
  Bottom 0.305: v60.2,24.38 v56.64,24.38 v38.86,24.38
N$18
  Top 0.305: BASS.2B 60.2,12.86 R9.P$1
N$19
  Top 0.305: BASS.1B 62.23,9.9 C14.P$2
N$20
  Top 0.305: BASS.3B 58.17,15.83 C15.P$1
N$21  (via drill 0.6)
  Top 0.305: C15.P$2 v58.17,23.37 | v40.89,23.37 R10.P$1 | 50.16,39.62 U3.7 | 50.16,39.62 52.45,37.34 54.4,37.34 55.37,36.37 55.37,32.51 55.12,32.26 v55.12,23.37 | C19.P$1 48.92,38.38 50.16,39.62
  Bottom 0.305: v58.17,23.37 v55.12,23.37 v40.89,23.37
N$22
  Top 0.305: 54.48,42.67 R11.P$2 | R12.P$1 54.48,42.55 | 54.48,42.55 R11.P$2 | R11.P$2 55.66,43.63 57.28,45.24 C18.P$1 | U3.5 52.7,42.14 53.11,42.55 54.48,42.55
N$23
  Top 0.305: U4.1 71.47,36.4 69.77,38.1 C27.P$2 68.04,36.77 67.34,36.07 66.65,36.07 66.29,35.71 66.29,30.54 76.51,20.32 88.8,20.32 89.15,19.96 R21.P$2
N$24
  Top 0.305: SUB_CUT.3A 87.12,5.91 87.12,14.22 89.15,16.26 R21.P$1
N$25
  Top 0.305: VOL.3B 15.49,6.34 15.49,4.02 17.48,2.03 18.78,2.03 20.57,3.83 R16.P$1
N$26
  Top 0.305: VOL.1B 22.86,8.8 R17.P$2
N$27
  Top 0.305: U4.7 78.03,33.91 78.49,34.37 78.49,37.53 79.05,38.1 C28.P$2 80.55,36.96 80.81,36.7 84.8,36.7 88.14,33.37 88.14,24.79 90.32,22.61 94.07,22.61 96.77,19.91 R23.P$2
N$28
  Top 0.305: SUB_CUT.3B 90.68,7.36 90.68,3.96 92.86,1.78 99.61,1.78 100.68,2.85 100.68,4.62 96.77,8.53 R23.P$1
N$29
  Top 0.305: R26.P$2 R25.P$2 81.09,42.36 81.41,42.67 84.12,42.67 86.11,40.69 86.11,39.88 90.42,35.56 92.66,35.56 93.34,36.24 U5.2 93.34,39.37 94.05,40.07 R28.P$1 C26.P$1
N$30
  Top 0.305: C26.P$2 R28.P$2 95.95,39.37 | 95.95,39.37 95.44,38.86 94.9,38.86 94.61,38.58 U5.1 | SUB_VOLUME.3A 73.48,0.51 100.48,0.51 102.11,2.13 102.11,38.59 101.33,39.37 95.95,39.37
N$31
  Top 0.305: U5.3 R29.P$1
N$32
  Top 0.305: SUB_VOLUME.2A 76.96,5.58 76.96,9.4 75.18,11.18 R31.P$2
N$33
  Top 0.305: U5.6 92.08,29.34 92.96,28.45 R30.P$2 R32.P$1
N$34
  Top 0.305: R30.P$1 92.96,26.31 93.32,26.67 96.16,26.67 96.52,27.03 96.52,28.39 95.95,28.96 94.87,28.96 93.34,30.48 U5.7 93.34,32.89 95,34.54 C25.P$1
N$35
  Top 0.305: U4.2 72.62,33.91 74.17,32.36 74.17,30.8 83.89,21.08 91.99,21.08 92.71,20.36 92.71,5.59 94.23,4.06 SUB_CUT.2A
N$36
  Top 0.305: R22.P$2 91.44,4.32 93.34,2.41 97.85,2.41 SUB_CUT.1A
N$37
  Top 0.305: SUB_CUT.1B 99.23,17.08 R24.P$2
N$38
  Top 0.305: U4.6 77.97,32.64 79.5,34.17 79.5,35.15 80.42,36.07 84.32,36.07 87.38,33.01 87.38,24.38 89.92,21.84 92.25,21.84 94.23,19.86 SUB_CUT.2B
N$39  (via drill 0.6)
  Top 0.305: VOL.2B 18.03,12.34 19.66,13.97 23.75,13.97 25.91,16.12 25.91,20.32 29.46,23.88 v31.5,23.88 | U3.2 50.16,33.66 49.78,33.27 49.78,31.34 48.16,29.72 39.4,29.72 36.58,26.9 36.58,24.89 v35.56,23.88
  Bottom 0.305: v31.5,23.88 v35.56,23.88
N$40
  Top 0.305: VOL.3A 9.91,6.93 9.91,9.14 12.95,12.19 R18.P$2
N$41
  Top 0.305: VOL.2A 16.51,5.32 16.51,13.97 25.4,22.86 25.4,29.11 26.01,29.72 27.98,29.72 28.7,30.44 28.7,31.88 30.86,34.04 U2.2
N$42
  Top 0.305: VOL.1A 20.5,1.27 17.13,1.27 14.73,3.67 14.73,4.57 11.18,8.13 11.18,9.41 13.45,11.68 14.67,11.68 15.24,12.25 R15.P$1
N$43
  Top 0.305: U5.5 C24.P$1 89.83,27.62 89.15,26.95 89.15,24.8 90.59,23.37 98.58,23.37 101.35,20.6 101.35,5.59 101.35,2.5 99.99,1.14 89.57,1.14 85.34,5.37 85.34,10.38 76.74,18.98 R31.P$1
N$44
  Top 0.305: C25.P$2 100.3,38.42 R27.P$1
N$45
  Top 0.305: C27.P$1 64.54,41.15 64.8,41.4 R26.P$1
N$46
  Top 0.305: C28.P$1 84.05,41.06 83.71,41.4 R25.P$1
N$47
  Top 0.305: 91.69,54.45 R33.P$2 | 91.69,54.45 C33.P$2 C34.P$1 90.83,50.71 91.69,49.84 R34.P$1 | 91.69,54.45 91.69,51.94 U6.3
N$48
  Top 0.305: U6.1 93.06,55.52 93.92,56.39 R35.P$1
N$49
  Top 0.254: C32.P$1 49.18,51.98 53.09,55.88 U1.P$10
OUT_L
  Top 0.305: C1.P$1 52.32,48.83 51.76,48.26 31.4,48.26 26.54,43.4 C12.P$2
OUT_R
  Top 0.305: C19.P$2 45.85,43.45 49.9,47.5 53.59,47.5 54.86,48.77 C2.P$1
OUT_SUB
  Top 0.305: R27.P$2 100.33,41.15 96.01,45.47 91.95,45.47 89.15,42.67 86.18,42.67 83.38,45.47 63.61,45.47 59.94,49.13 C3.P$1
R+
  Top 0.305: U1.P$5 45.34,53.85 30.48,53.85 20.07,43.43 20.07,35.56 16.26,31.75 J3.P$2
R-
  Top 0.305: U1.P$3 44.07,54.61 30.23,54.61 19.3,43.69 19.3,37.08 16.51,34.29 J3.P$1
SUB+  (via drill 0.6)
  Top 0.305: J4.P$1 17.78,21.08 22.35,25.65 22.35,42.67 31.24,51.56 39.62,51.56 v39.88,51.31
  Bottom 0.305: v39.88,51.31 40.89,52.32 56.01,52.32 U1.P$17
SUB-  (via drill 0.6)
  Top 0.305: v39.88,50.04 39.12,50.8 31.5,50.8 23.11,42.42 23.11,25.4 16.26,18.54 J4.P$2
  Bottom 0.305: U1.P$19 57.28,51.56 41.4,51.56 v39.88,50.04
SUB_L
  Top 0.305: U4.3 67.74,32.64 | 67.74,32.64 C22.P$2 | 67.74,32.64 67.74,33.48 67.24,33.98 R19.P$1
SUB_R
  Top 0.305: U4.5 80.59,31.37 C23.P$2 80.59,33.35 81.09,33.85 R20.P$1
TDA7387_IN1
  Top 0.305: C1.P$2 52.32,53.59 54.1,55.37 U1.P$11
TDA7387_IN2
  Top 0.254: 55.12,53.01 U1.P$12
  Top 0.305: C2.P$2 55.12,53.01
TDA7387_IN3
  Top 0.305: C3.P$2 59.94,53.59 58.17,55.37 U1.P$15
TDA7387_IN4
  Top 0.254: 57.15,53.01 U1.P$14
  Top 0.305: 57.15,53.01 C4.P$2
VGND  (via drill 0.6)
  Top 0.305: C11.P$2 39.75,39.56 37.47,39.56 | 37.47,39.56 R6.P$2 | C18.P$2 59.05,39.56 R12.P$2 56.64,39.56 v56.64,40.64 | U6.2 94.88,53.21 96.71,55.04 R35.P$2 v98.04,56.39 | R18.P$1 v12.95,16 | R17.P$1 v22.86,16 | R14.P$2 v35.05,33.27 | R13.P$2 v54.36,33.27 | R19.P$2 v64.26,34.8 | R20.P$2 v84.07,34.8 | C24.P$2 v90.81,24.77 | R32.P$2 v95.12,24.77 | R22.P$1 v91.44,20.07 | R24.P$1 v99.06,20.07 | R29.P$2 v92.08,44.32 | 37.47,39.56 v37.47,40.64
  Route15 0.305: v12.95,16 12.7,16 | v22.86,16 22.86,16.51 | v35.05,33.27 34.54,33.27 34.54,33.78 | v54.36,33.27 54.36,33.53 | v64.26,34.8 64.26,35.05 | v84.07,34.8 84.07,35.31 | v90.81,24.77 90.55,24.77 90.42,24.89 | v95.12,24.77 94.87,24.77 94.74,24.89 | v91.44,20.07 90.93,20.07 | v99.06,20.07 98.55,20.07 | v92.08,44.32 91.82,44.32 91.69,44.2 | v98.04,56.39 98.3,56.39 | v56.64,40.64 56.64,40.89
  pour Route15: 107.82,0 4.45,0 arc-90 0,4.45 0,60.07 arc-90 4.45,64.52 107.82,64.52 arc-90 112.27,60.07 112.27,4.45 arc-90
VIN  (via drill 0.6)
  Top 0.254: C29.P$1 12.68,55.4 12.7,55.37
  Top 0.305: U2.8 v29.59,42.93 32.19,45.53 R5.P$1 | 91.69,59.69 100.92,59.69 102.36,58.25 102.36,54.48 | 91.69,59.69 R33.P$1 | C33.P$1 87.28,59.69 91.69,59.69 | U5.8 94.61,30.66 95.3,29.97 v97.54,29.97 | v102.36,47.75 102.36,54.48 | U4.8 76.87,36.32 v76.96,36.32 | R11.P$1 51.5,45.53 v48.9,42.93 U3.8 | U6.8 102.36,54.48
  Top 1.27: C31.P$1 36.83,62.87 38.86,62.87 | 12.7,56.64 C29.P$1
  Top 1.676: U1.P$4 46.99,62.87 | U1.P$6 49.02,62.87 48.77,62.87 | U1.P$20 63.25,62.87 65.28,62.87 U1.P$22 | C35.P$1 30.48,62.87 30.73,62.87
  Top 2.54: J5.P$1 11.33,53.34 12.7,54.71 12.7,55.37 12.7,61.21 14.35,62.87 30.73,62.87 38.86,62.87 46.99,62.87 48.77,62.87 63.25,62.87 85.57,62.87 87.12,61.31 C33.P$1 87.12,58.93
  Bottom 0.305: v97.54,29.97 97.54,42.93 | 97.54,42.93 v102.36,47.75 | v76.96,36.32 76.96,42.93 | 76.96,42.93 97.54,42.93 | v29.59,42.93 v48.9,42.93 76.96,42.93